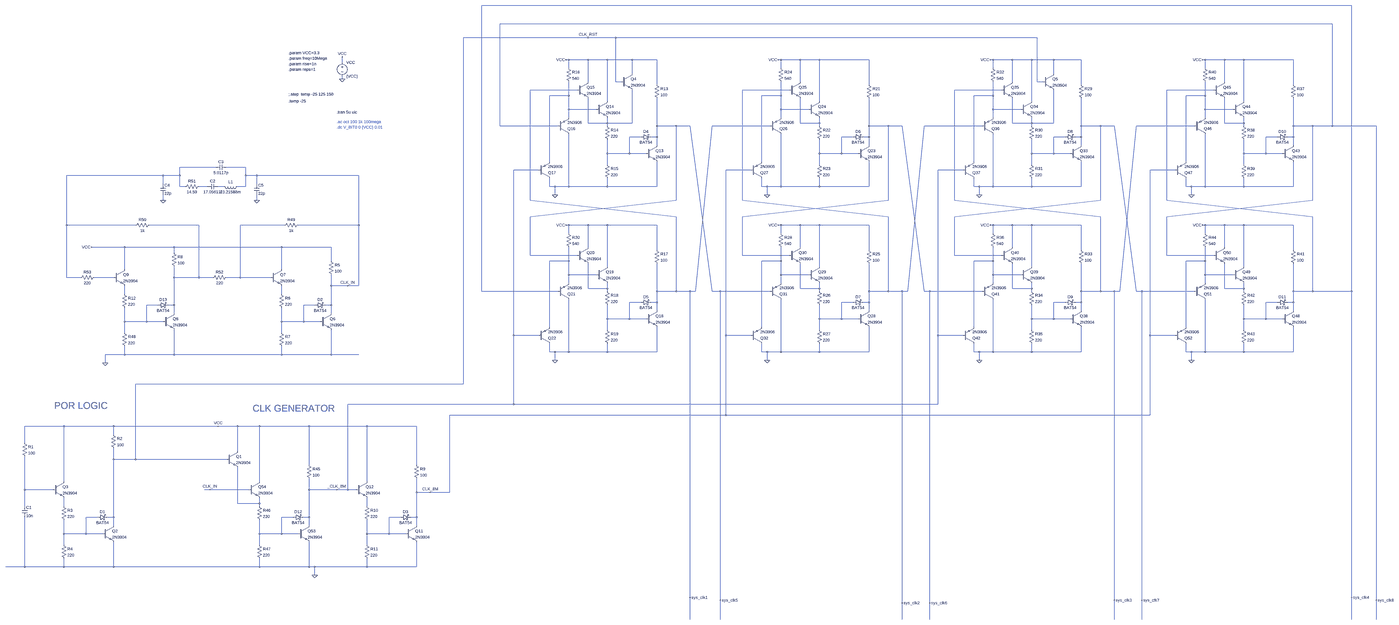
[diagram p0: schematic clock_gen.asc, whole sheet]
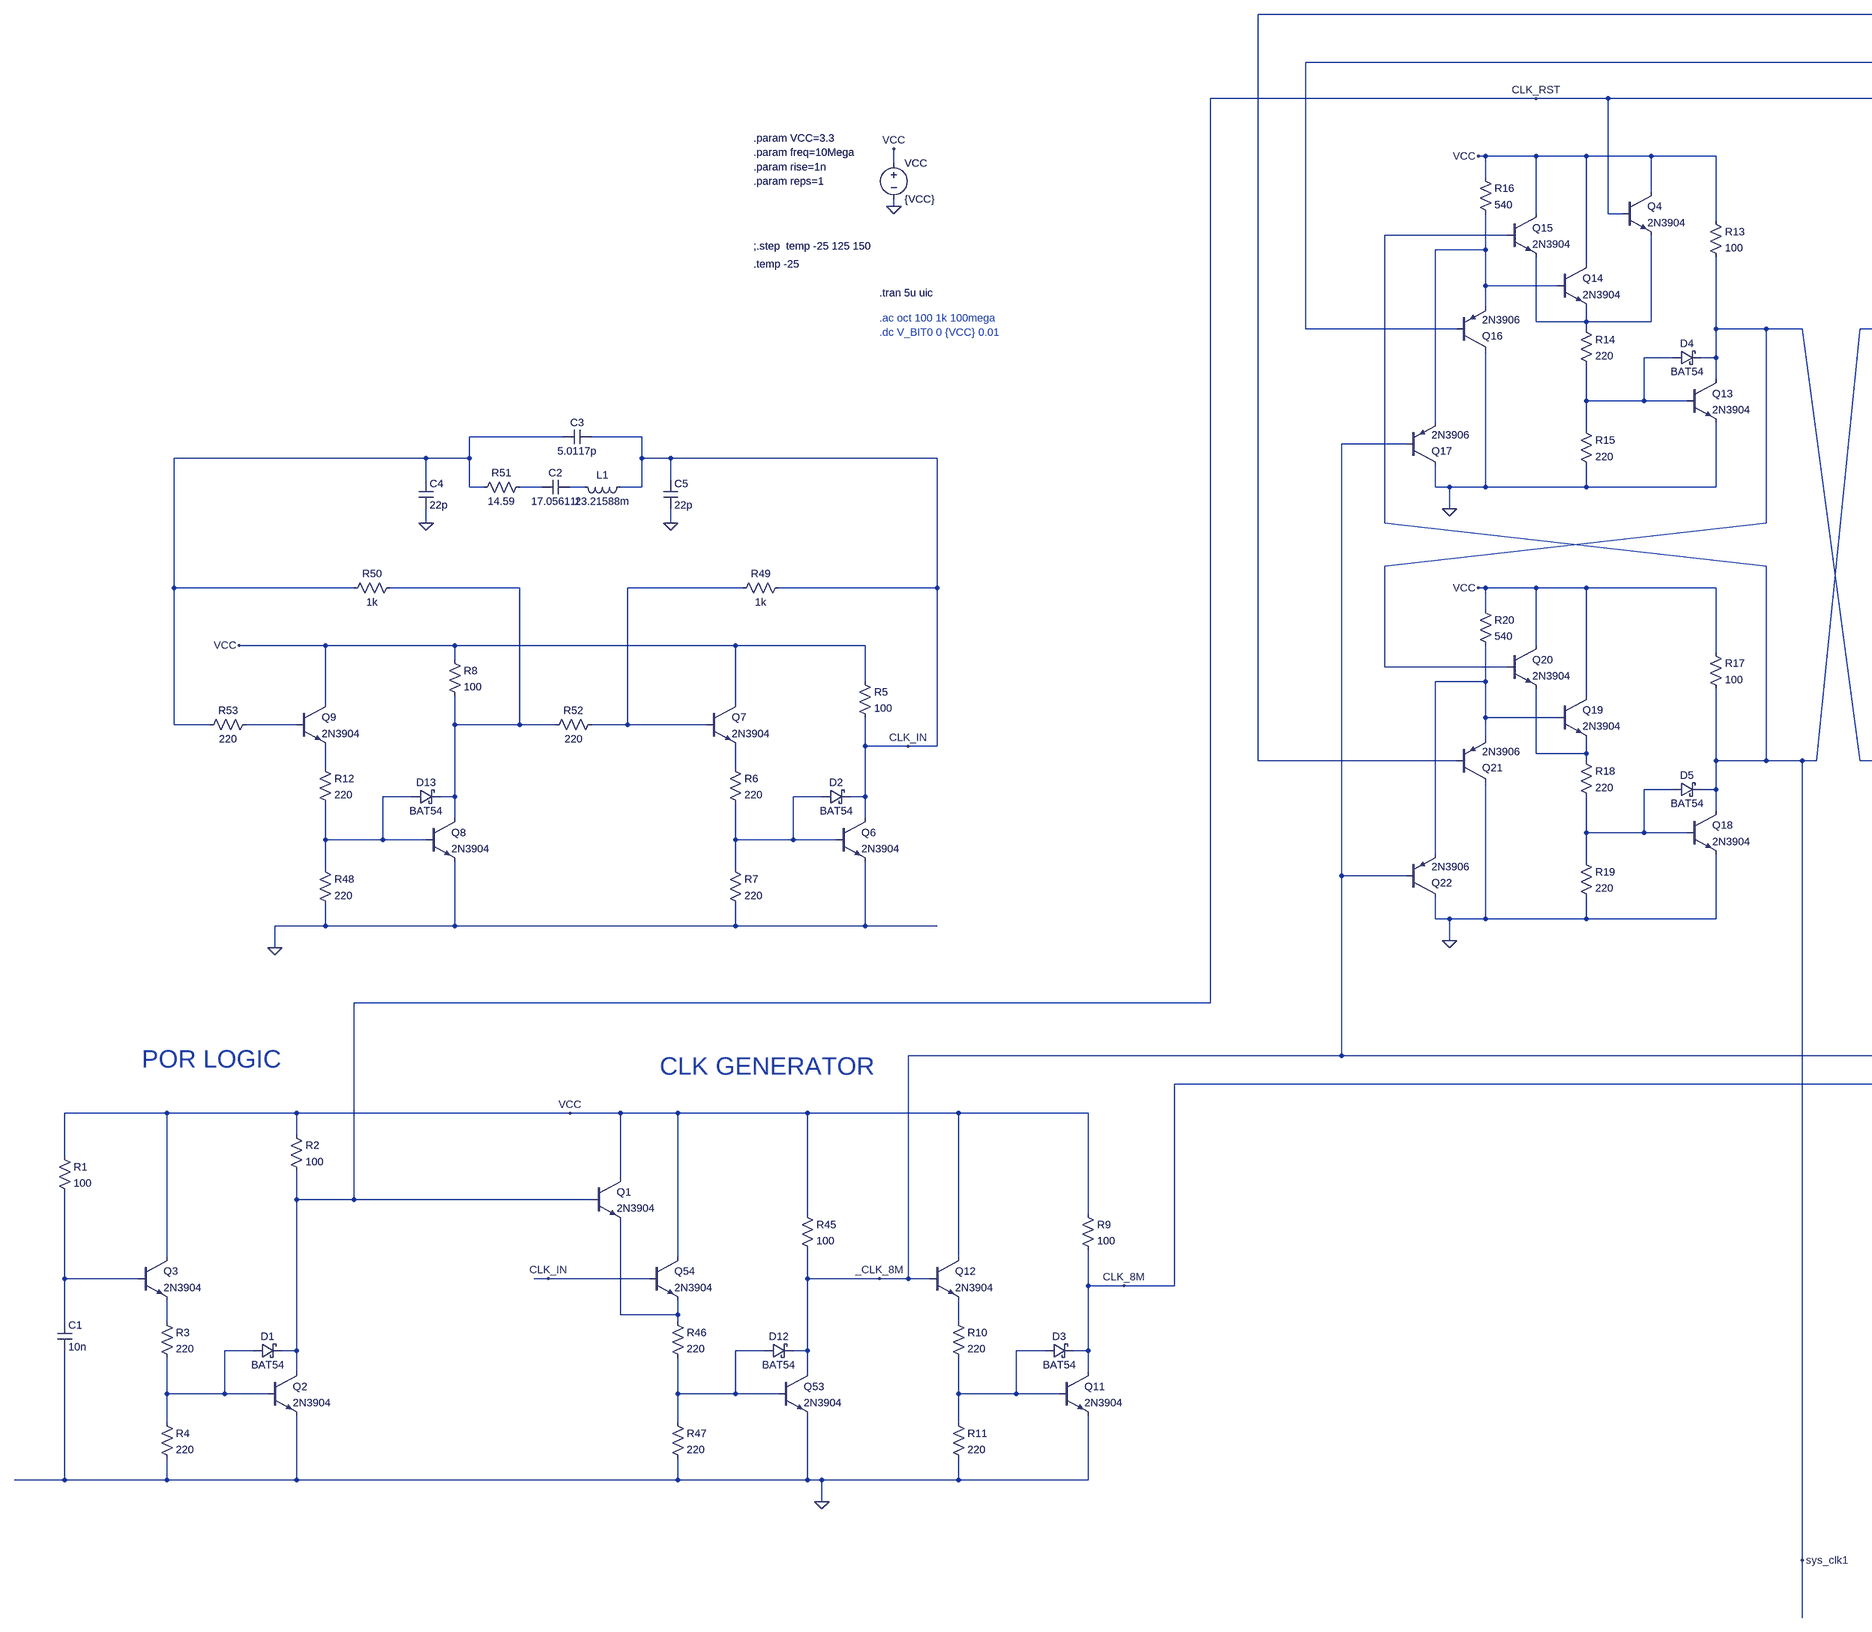
[diagram p1: schematic clock_gen.asc, part, row 1 of 1, column 1 of 2]
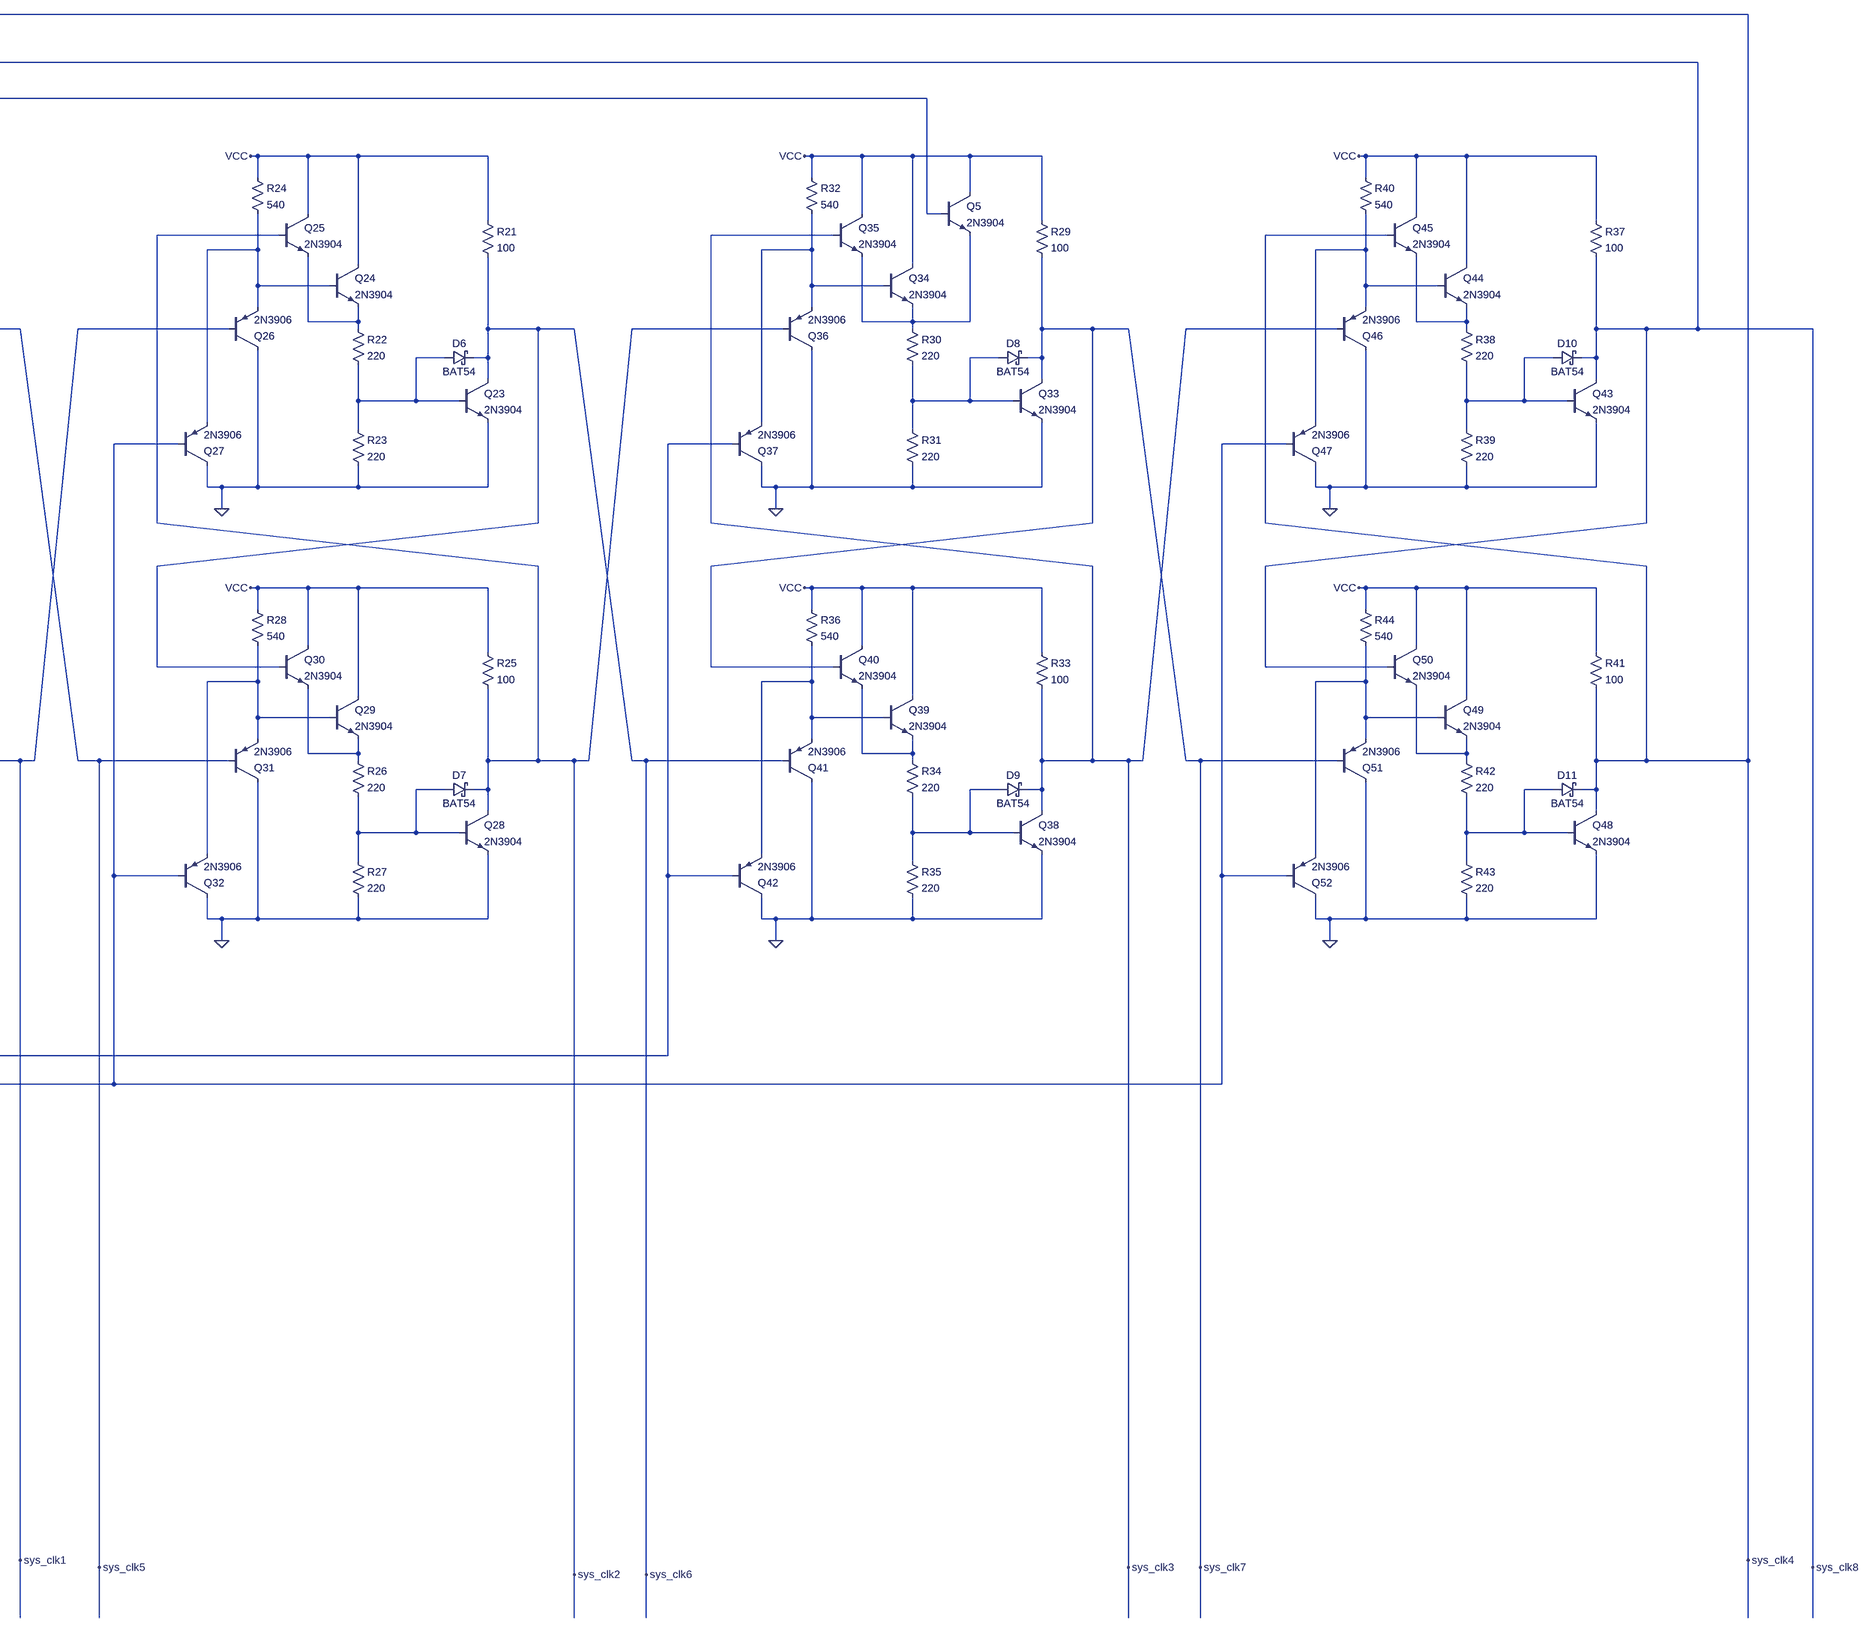
[diagram p2: schematic clock_gen.asc, part, row 1 of 1, column 2 of 2]
clock_gen.asc, the LTspice schematic file:
Version 4.1
SHEET 1 14868 10612
WIRE 8016 2768 2848 2768
WIRE 7904 2880 2992 2880
WIRE 3504 2960 2672 2960
WIRE 3664 2960 3504 2960
WIRE 6112 2960 3664 2960
WIRE 3392 3088 3376 3088
WIRE 3504 3088 3392 3088
WIRE 3616 3088 3504 3088
WIRE 3760 3088 3616 3088
WIRE 3904 3088 3760 3088
WIRE 4624 3088 4608 3088
WIRE 4736 3088 4624 3088
WIRE 4848 3088 4736 3088
WIRE 5136 3088 4848 3088
WIRE 5856 3088 5840 3088
WIRE 5968 3088 5856 3088
WIRE 6080 3088 5968 3088
WIRE 6208 3088 6080 3088
WIRE 6368 3088 6208 3088
WIRE 7088 3088 7072 3088
WIRE 7200 3088 7088 3088
WIRE 7312 3088 7200 3088
WIRE 7600 3088 7312 3088
WIRE 1968 3104 1968 3072
WIRE 3392 3136 3392 3088
WIRE 4624 3136 4624 3088
WIRE 5856 3136 5856 3088
WIRE 7088 3136 7088 3088
WIRE 3760 3168 3760 3088
WIRE 6208 3168 6208 3088
WIRE 1968 3200 1968 3184
WIRE 3504 3216 3504 3088
WIRE 3664 3216 3664 2960
WIRE 3696 3216 3664 3216
WIRE 4736 3216 4736 3088
WIRE 5968 3216 5968 3088
WIRE 6112 3216 6112 2960
WIRE 6144 3216 6112 3216
WIRE 7200 3216 7200 3088
WIRE 3904 3232 3904 3088
WIRE 5136 3232 5136 3088
WIRE 6368 3232 6368 3088
WIRE 7600 3232 7600 3088
WIRE 3440 3264 3168 3264
WIRE 4672 3264 4400 3264
WIRE 5904 3264 5632 3264
WIRE 7136 3264 6864 3264
WIRE 3392 3296 3392 3216
WIRE 3392 3296 3280 3296
WIRE 4624 3296 4624 3216
WIRE 4624 3296 4512 3296
WIRE 5856 3296 5856 3216
WIRE 5856 3296 5744 3296
WIRE 7088 3296 7088 3216
WIRE 7088 3296 6976 3296
WIRE 3616 3328 3616 3088
WIRE 4848 3328 4848 3088
WIRE 6080 3328 6080 3088
WIRE 7312 3328 7312 3088
WIRE 3392 3376 3392 3296
WIRE 3552 3376 3392 3376
WIRE 4624 3376 4624 3296
WIRE 4784 3376 4624 3376
WIRE 5856 3376 5856 3296
WIRE 6016 3376 5856 3376
WIRE 7088 3376 7088 3296
WIRE 7248 3376 7088 3376
WIRE 3392 3424 3392 3376
WIRE 4624 3424 4624 3376
WIRE 5856 3424 5856 3376
WIRE 7088 3424 7088 3376
WIRE 3504 3456 3504 3312
WIRE 3616 3456 3616 3424
WIRE 3616 3456 3504 3456
WIRE 3760 3456 3760 3264
WIRE 3760 3456 3616 3456
WIRE 4736 3456 4736 3312
WIRE 4848 3456 4848 3424
WIRE 4848 3456 4736 3456
WIRE 5968 3456 5968 3312
WIRE 6080 3456 6080 3424
WIRE 6080 3456 5968 3456
WIRE 6208 3456 6208 3264
WIRE 6208 3456 6080 3456
WIRE 7200 3456 7200 3312
WIRE 7312 3456 7312 3424
WIRE 7312 3456 7200 3456
WIRE 2992 3472 2992 2880
WIRE 3328 3472 2992 3472
WIRE 3616 3472 3616 3456
WIRE 3904 3472 3904 3312
WIRE 4016 3472 3904 3472
WIRE 4096 3472 4016 3472
WIRE 4560 3472 4224 3472
WIRE 4848 3472 4848 3456
WIRE 5136 3472 5136 3312
WIRE 5248 3472 5136 3472
WIRE 5328 3472 5248 3472
WIRE 5792 3472 5456 3472
WIRE 6080 3472 6080 3456
WIRE 6368 3472 6368 3312
WIRE 6480 3472 6368 3472
WIRE 6560 3472 6480 3472
WIRE 7024 3472 6688 3472
WIRE 7312 3472 7312 3456
WIRE 7600 3472 7600 3312
WIRE 7712 3472 7600 3472
WIRE 7904 3472 7904 2880
WIRE 7904 3472 7712 3472
WIRE 8160 3472 7904 3472
WIRE 3808 3536 3744 3536
WIRE 3904 3536 3904 3472
WIRE 3904 3536 3872 3536
WIRE 5040 3536 4976 3536
WIRE 5136 3536 5136 3472
WIRE 5136 3536 5104 3536
WIRE 6272 3536 6208 3536
WIRE 6368 3536 6368 3472
WIRE 6368 3536 6336 3536
WIRE 7504 3536 7440 3536
WIRE 7600 3536 7600 3472
WIRE 7600 3536 7568 3536
WIRE 3904 3584 3904 3536
WIRE 5136 3584 5136 3536
WIRE 6368 3584 6368 3536
WIRE 7600 3584 7600 3536
WIRE 3616 3632 3616 3552
WIRE 3744 3632 3744 3536
WIRE 3744 3632 3616 3632
WIRE 3840 3632 3744 3632
WIRE 4848 3632 4848 3552
WIRE 4976 3632 4976 3536
WIRE 4976 3632 4848 3632
WIRE 5072 3632 4976 3632
WIRE 6080 3632 6080 3552
WIRE 6208 3632 6208 3536
WIRE 6208 3632 6080 3632
WIRE 6304 3632 6208 3632
WIRE 7312 3632 7312 3552
WIRE 7440 3632 7440 3536
WIRE 7440 3632 7312 3632
WIRE 7536 3632 7440 3632
WIRE 3280 3680 3280 3296
WIRE 4512 3680 4512 3296
WIRE 5744 3680 5744 3296
WIRE 6976 3680 6976 3296
WIRE 3616 3696 3616 3632
WIRE 4848 3696 4848 3632
WIRE 6080 3696 6080 3632
WIRE 7312 3696 7312 3632
WIRE 1232 3712 1024 3712
WIRE 1408 3712 1296 3712
WIRE 3216 3728 3072 3728
WIRE 4448 3728 4304 3728
WIRE 5680 3728 5536 3728
WIRE 6912 3728 6768 3728
WIRE 928 3760 368 3760
WIRE 1024 3760 1024 3712
WIRE 1024 3760 928 3760
WIRE 1408 3760 1408 3712
WIRE 1472 3760 1408 3760
WIRE 2064 3760 1472 3760
WIRE 928 3808 928 3760
WIRE 1472 3808 1472 3760
WIRE 1024 3824 1024 3760
WIRE 1056 3824 1024 3824
WIRE 1184 3824 1136 3824
WIRE 1280 3824 1248 3824
WIRE 1408 3824 1408 3760
WIRE 1408 3824 1360 3824
WIRE 3280 3824 3280 3776
WIRE 3312 3824 3280 3824
WIRE 3392 3824 3392 3520
WIRE 3392 3824 3312 3824
WIRE 3616 3824 3616 3776
WIRE 3616 3824 3392 3824
WIRE 3904 3824 3904 3680
WIRE 3904 3824 3616 3824
WIRE 4512 3824 4512 3776
WIRE 4544 3824 4512 3824
WIRE 4624 3824 4624 3520
WIRE 4624 3824 4544 3824
WIRE 4848 3824 4848 3776
WIRE 4848 3824 4624 3824
WIRE 5136 3824 5136 3680
WIRE 5136 3824 4848 3824
WIRE 5744 3824 5744 3776
WIRE 5776 3824 5744 3824
WIRE 5856 3824 5856 3520
WIRE 5856 3824 5776 3824
WIRE 6080 3824 6080 3776
WIRE 6080 3824 5856 3824
WIRE 6368 3824 6368 3680
WIRE 6368 3824 6080 3824
WIRE 6976 3824 6976 3776
WIRE 7008 3824 6976 3824
WIRE 7088 3824 7088 3520
WIRE 7088 3824 7008 3824
WIRE 7312 3824 7312 3776
WIRE 7312 3824 7088 3824
WIRE 7600 3824 7600 3680
WIRE 7600 3824 7312 3824
WIRE 3312 3872 3312 3824
WIRE 4544 3872 4544 3824
WIRE 5776 3872 5776 3824
WIRE 7008 3872 7008 3824
WIRE 928 3904 928 3872
WIRE 1472 3904 1472 3872
WIRE 3168 3904 3168 3264
WIRE 4016 3904 4016 3472
WIRE 4400 3904 4400 3264
WIRE 5248 3904 5248 3472
WIRE 5632 3904 5632 3264
WIRE 6480 3904 6480 3472
WIRE 6864 3904 6864 3264
WIRE 7712 3904 7712 3472
WIRE 3168 4000 4016 3904
WIRE 4016 4000 3168 3904
WIRE 4400 4000 5248 3904
WIRE 5248 4000 4400 3904
WIRE 5632 4000 6480 3904
WIRE 6480 4000 5632 3904
WIRE 6864 4000 7712 3904
WIRE 7712 4000 6864 3904
WIRE 368 4048 368 3760
WIRE 768 4048 368 4048
WIRE 1136 4048 848 4048
WIRE 1632 4048 1376 4048
WIRE 2064 4048 2064 3760
WIRE 2064 4048 1712 4048
WIRE 3392 4048 3376 4048
WIRE 3504 4048 3392 4048
WIRE 3616 4048 3504 4048
WIRE 3904 4048 3616 4048
WIRE 4624 4048 4608 4048
WIRE 4736 4048 4624 4048
WIRE 4848 4048 4736 4048
WIRE 5136 4048 4848 4048
WIRE 5856 4048 5840 4048
WIRE 5968 4048 5856 4048
WIRE 6080 4048 5968 4048
WIRE 6368 4048 6080 4048
WIRE 7088 4048 7072 4048
WIRE 7200 4048 7088 4048
WIRE 7312 4048 7200 4048
WIRE 7600 4048 7312 4048
WIRE 3392 4096 3392 4048
WIRE 4624 4096 4624 4048
WIRE 5856 4096 5856 4048
WIRE 7088 4096 7088 4048
WIRE 704 4176 512 4176
WIRE 992 4176 704 4176
WIRE 1616 4176 992 4176
WIRE 1904 4176 1616 4176
WIRE 3504 4176 3504 4048
WIRE 4736 4176 4736 4048
WIRE 5968 4176 5968 4048
WIRE 7200 4176 7200 4048
WIRE 3904 4192 3904 4048
WIRE 5136 4192 5136 4048
WIRE 6368 4192 6368 4048
WIRE 7600 4192 7600 4048
WIRE 992 4208 992 4176
WIRE 3168 4224 3168 4000
WIRE 3440 4224 3168 4224
WIRE 4400 4224 4400 4000
WIRE 4672 4224 4400 4224
WIRE 5632 4224 5632 4000
WIRE 5904 4224 5632 4224
WIRE 6864 4224 6864 4000
WIRE 7136 4224 6864 4224
WIRE 1904 4256 1904 4176
WIRE 3392 4256 3392 4176
WIRE 3392 4256 3280 4256
WIRE 4624 4256 4624 4176
WIRE 4624 4256 4512 4256
WIRE 5856 4256 5856 4176
WIRE 5856 4256 5744 4256
WIRE 7088 4256 7088 4176
WIRE 7088 4256 6976 4256
WIRE 3616 4288 3616 4048
WIRE 4848 4288 4848 4048
WIRE 6080 4288 6080 4048
WIRE 7312 4288 7312 4048
WIRE 704 4304 704 4176
WIRE 1616 4304 1616 4176
WIRE 3392 4336 3392 4256
WIRE 3552 4336 3392 4336
WIRE 4624 4336 4624 4256
WIRE 4784 4336 4624 4336
WIRE 5856 4336 5856 4256
WIRE 6016 4336 5856 4336
WIRE 7088 4336 7088 4256
WIRE 7248 4336 7088 4336
WIRE 368 4352 368 4048
WIRE 448 4352 368 4352
WIRE 640 4352 528 4352
WIRE 992 4352 992 4288
WIRE 1136 4352 1136 4048
WIRE 1136 4352 992 4352
WIRE 1216 4352 1136 4352
WIRE 1376 4352 1376 4048
WIRE 1376 4352 1296 4352
WIRE 1552 4352 1376 4352
WIRE 3392 4384 3392 4336
WIRE 4624 4384 4624 4336
WIRE 5856 4384 5856 4336
WIRE 7088 4384 7088 4336
WIRE 1904 4400 1904 4336
WIRE 2000 4400 1904 4400
WIRE 2064 4400 2064 4048
WIRE 2064 4400 2000 4400
WIRE 3504 4416 3504 4272
WIRE 3616 4416 3616 4384
WIRE 3616 4416 3504 4416
WIRE 4736 4416 4736 4272
WIRE 4848 4416 4848 4384
WIRE 4848 4416 4736 4416
WIRE 5968 4416 5968 4272
WIRE 6080 4416 6080 4384
WIRE 6080 4416 5968 4416
WIRE 7200 4416 7200 4272
WIRE 7312 4416 7312 4384
WIRE 7312 4416 7200 4416
WIRE 2848 4432 2848 2768
WIRE 3328 4432 2848 4432
WIRE 3616 4432 3616 4416
WIRE 3904 4432 3904 4272
WIRE 4016 4432 4016 4000
WIRE 4016 4432 3904 4432
WIRE 4096 4432 4016 4432
WIRE 4128 4432 4224 3472
WIRE 4128 4432 4096 4432
WIRE 4224 4432 4096 3472
WIRE 4272 4432 4224 4432
WIRE 4560 4432 4272 4432
WIRE 4848 4432 4848 4416
WIRE 5136 4432 5136 4272
WIRE 5248 4432 5248 4000
WIRE 5248 4432 5136 4432
WIRE 5328 4432 5248 4432
WIRE 5360 4432 5456 3472
WIRE 5360 4432 5328 4432
WIRE 5456 4432 5328 3472
WIRE 5488 4432 5456 4432
WIRE 5792 4432 5488 4432
WIRE 6080 4432 6080 4416
WIRE 6368 4432 6368 4272
WIRE 6480 4432 6480 4000
WIRE 6480 4432 6368 4432
WIRE 6560 4432 6480 4432
WIRE 6592 4432 6688 3472
WIRE 6592 4432 6560 4432
WIRE 6688 4432 6560 3472
WIRE 6720 4432 6688 4432
WIRE 7024 4432 6720 4432
WIRE 7312 4432 7312 4416
WIRE 7600 4432 7600 4272
WIRE 7712 4432 7712 4000
WIRE 7712 4432 7600 4432
WIRE 8016 4432 8016 2768
WIRE 8016 4432 7712 4432
WIRE 704 4448 704 4400
WIRE 1616 4448 1616 4400
WIRE 3808 4496 3744 4496
WIRE 3904 4496 3904 4432
WIRE 3904 4496 3872 4496
WIRE 5040 4496 4976 4496
WIRE 5136 4496 5136 4432
WIRE 5136 4496 5104 4496
WIRE 6272 4496 6208 4496
WIRE 6368 4496 6368 4432
WIRE 6368 4496 6336 4496
WIRE 7504 4496 7440 4496
WIRE 7600 4496 7600 4432
WIRE 7600 4496 7568 4496
WIRE 896 4512 832 4512
WIRE 992 4512 992 4352
WIRE 992 4512 960 4512
WIRE 1808 4512 1744 4512
WIRE 1904 4512 1904 4400
WIRE 1904 4512 1872 4512
WIRE 3904 4544 3904 4496
WIRE 5136 4544 5136 4496
WIRE 6368 4544 6368 4496
WIRE 7600 4544 7600 4496
WIRE 992 4560 992 4512
WIRE 1904 4560 1904 4512
WIRE 3616 4592 3616 4512
WIRE 3744 4592 3744 4496
WIRE 3744 4592 3616 4592
WIRE 3840 4592 3744 4592
WIRE 4848 4592 4848 4512
WIRE 4976 4592 4976 4496
WIRE 4976 4592 4848 4592
WIRE 5072 4592 4976 4592
WIRE 6080 4592 6080 4512
WIRE 6208 4592 6208 4496
WIRE 6208 4592 6080 4592
WIRE 6304 4592 6208 4592
WIRE 7312 4592 7312 4512
WIRE 7440 4592 7440 4496
WIRE 7440 4592 7312 4592
WIRE 7536 4592 7440 4592
WIRE 704 4608 704 4528
WIRE 832 4608 832 4512
WIRE 832 4608 704 4608
WIRE 928 4608 832 4608
WIRE 1616 4608 1616 4528
WIRE 1744 4608 1744 4512
WIRE 1744 4608 1616 4608
WIRE 1840 4608 1744 4608
WIRE 3280 4640 3280 4256
WIRE 4512 4640 4512 4256
WIRE 5744 4640 5744 4256
WIRE 6976 4640 6976 4256
WIRE 3616 4656 3616 4592
WIRE 4848 4656 4848 4592
WIRE 6080 4656 6080 4592
WIRE 7312 4656 7312 4592
WIRE 704 4672 704 4608
WIRE 1616 4672 1616 4608
WIRE 3072 4688 3072 3728
WIRE 3216 4688 3072 4688
WIRE 4304 4688 4304 3728
WIRE 4448 4688 4304 4688
WIRE 5536 4688 5536 3728
WIRE 5680 4688 5536 4688
WIRE 6768 4688 6768 3728
WIRE 6912 4688 6768 4688
WIRE 3280 4784 3280 4736
WIRE 3312 4784 3280 4784
WIRE 3392 4784 3392 4480
WIRE 3392 4784 3312 4784
WIRE 3616 4784 3616 4736
WIRE 3616 4784 3392 4784
WIRE 3904 4784 3904 4640
WIRE 3904 4784 3616 4784
WIRE 4512 4784 4512 4736
WIRE 4544 4784 4512 4784
WIRE 4624 4784 4624 4480
WIRE 4624 4784 4544 4784
WIRE 4848 4784 4848 4736
WIRE 4848 4784 4624 4784
WIRE 5136 4784 5136 4640
WIRE 5136 4784 4848 4784
WIRE 5744 4784 5744 4736
WIRE 5776 4784 5744 4784
WIRE 5856 4784 5856 4480
WIRE 5856 4784 5776 4784
WIRE 6080 4784 6080 4736
WIRE 6080 4784 5856 4784
WIRE 6368 4784 6368 4640
WIRE 6368 4784 6080 4784
WIRE 6976 4784 6976 4736
WIRE 7008 4784 6976 4784
WIRE 7088 4784 7088 4480
WIRE 7088 4784 7008 4784
WIRE 7312 4784 7312 4736
WIRE 7312 4784 7088 4784
WIRE 7600 4784 7600 4640
WIRE 7600 4784 7312 4784
WIRE 704 4800 704 4752
WIRE 704 4800 592 4800
WIRE 992 4800 992 4656
WIRE 992 4800 704 4800
WIRE 1616 4800 1616 4752
WIRE 1616 4800 992 4800
WIRE 1904 4800 1904 4656
WIRE 1904 4800 1616 4800
WIRE 2064 4800 1904 4800
WIRE 3312 4832 3312 4784
WIRE 4544 4832 4544 4784
WIRE 5776 4832 5776 4784
WIRE 7008 4832 7008 4784
WIRE 592 4848 592 4800
WIRE 2672 5232 2672 2960
WIRE 2672 5232 768 5232
WIRE 3072 5376 3072 4688
WIRE 3072 5376 2000 5376
WIRE 5536 5376 5536 4688
WIRE 5536 5376 3072 5376
WIRE 4304 5440 4304 4688
WIRE 4304 5440 2592 5440
WIRE 6768 5440 6768 4688
WIRE 6768 5440 4304 5440
WIRE 352 5504 48 5504
WIRE 640 5504 352 5504
WIRE 1248 5504 640 5504
WIRE 1360 5504 1248 5504
WIRE 1488 5504 1360 5504
WIRE 1776 5504 1488 5504
WIRE 2112 5504 1776 5504
WIRE 2400 5504 2112 5504
WIRE 640 5552 640 5504
WIRE 48 5600 48 5504
WIRE 1360 5648 1360 5504
WIRE 640 5696 640 5632
WIRE 768 5696 768 5232
WIRE 768 5696 640 5696
WIRE 1296 5696 768 5696
WIRE 1776 5728 1776 5504
WIRE 2400 5728 2400 5504
WIRE 352 5824 352 5504
WIRE 1488 5824 1488 5504
WIRE 2112 5824 2112 5504
WIRE 48 5872 48 5680
WIRE 288 5872 48 5872
WIRE 1200 5872 1168 5872
WIRE 1424 5872 1200 5872
WIRE 1776 5872 1776 5808
WIRE 1936 5872 1776 5872
WIRE 2000 5872 2000 5376
WIRE 2000 5872 1936 5872
WIRE 2048 5872 2000 5872
WIRE 2400 5888 2400 5808
WIRE 2480 5888 2400 5888
WIRE 2592 5888 2592 5440
WIRE 2592 5888 2480 5888
WIRE 1360 5952 1360 5744
WIRE 1488 5952 1488 5920
WIRE 1488 5952 1360 5952
WIRE 48 5968 48 5872
WIRE 352 5968 352 5920
WIRE 1488 5968 1488 5952
WIRE 2112 5968 2112 5920
WIRE 544 6032 480 6032
WIRE 640 6032 640 5696
WIRE 640 6032 608 6032
WIRE 1680 6032 1616 6032
WIRE 1776 6032 1776 5872
WIRE 1776 6032 1744 6032
WIRE 2304 6032 2240 6032
WIRE 2400 6032 2400 5888
WIRE 2400 6032 2368 6032
WIRE 640 6080 640 6032
WIRE 1776 6080 1776 6032
WIRE 2400 6080 2400 6032
WIRE 352 6128 352 6048
WIRE 480 6128 480 6032
WIRE 480 6128 352 6128
WIRE 576 6128 480 6128
WIRE 1488 6128 1488 6048
WIRE 1616 6128 1616 6032
WIRE 1616 6128 1488 6128
WIRE 1712 6128 1616 6128
WIRE 2112 6128 2112 6048
WIRE 2240 6128 2240 6032
WIRE 2240 6128 2112 6128
WIRE 2336 6128 2240 6128
WIRE 352 6192 352 6128
WIRE 1488 6192 1488 6128
WIRE 2112 6192 2112 6128
WIRE 48 6320 48 6032
WIRE 48 6320 -64 6320
WIRE 352 6320 352 6272
WIRE 352 6320 48 6320
WIRE 640 6320 640 6176
WIRE 640 6320 352 6320
WIRE 1488 6320 1488 6272
WIRE 1488 6320 640 6320
WIRE 1776 6320 1776 6176
WIRE 1776 6320 1488 6320
WIRE 1808 6320 1776 6320
WIRE 2112 6320 2112 6272
WIRE 2112 6320 1808 6320
WIRE 2400 6320 2400 6176
WIRE 2400 6320 2112 6320
WIRE 1808 6368 1808 6320
WIRE 4096 6928 4096 4432
WIRE 8016 6928 8016 4432
WIRE 4272 6944 4272 4432
WIRE 6560 6944 6560 4432
WIRE 6720 6944 6720 4432
WIRE 8160 6944 8160 3472
WIRE 5328 6960 5328 4432
WIRE 5488 6960 5488 4432
WIRE 4096 7056 4096 6928
WIRE 4272 7056 4272 6944
WIRE 5328 7056 5328 6960
WIRE 5488 7056 5488 6960
WIRE 6560 7056 6560 6944
WIRE 6720 7056 6720 6944
WIRE 8016 7056 8016 6928
WIRE 8160 7056 8160 6944
FLAG 1968 3200 0
FLAG 1968 3072 VCC
FLAG 1808 6368 0
FLAG 1936 5872 _CLK_8M
FLAG 2480 5888 CLK_8M
FLAG 3312 3872 0
FLAG 3376 3088 VCC
FLAG 3312 4832 0
FLAG 3376 4048 VCC
FLAG 4544 3872 0
FLAG 4608 3088 VCC
FLAG 4544 4832 0
FLAG 4608 4048 VCC
FLAG 5776 3872 0
FLAG 5840 3088 VCC
FLAG 5776 4832 0
FLAG 5840 4048 VCC
FLAG 7008 3872 0
FLAG 7072 3088 VCC
FLAG 7008 4832 0
FLAG 7072 4048 VCC
FLAG 1200 5872 CLK_IN
FLAG 1248 5504 VCC
FLAG 3504 2960 CLK_RST
FLAG 4096 6928 sys_clk1
FLAG 5328 6960 sys_clk2
FLAG 6560 6944 sys_clk3
FLAG 8016 6928 sys_clk4
FLAG 4272 6944 sys_clk5
FLAG 5488 6960 sys_clk6
FLAG 6720 6944 sys_clk7
FLAG 8160 6944 sys_clk8
FLAG 2000 4400 CLK_IN
FLAG 512 4176 VCC
FLAG 592 4848 0
FLAG 928 3904 0
FLAG 1472 3904 0
SYMBOL voltage 1968 3088 R0
WINDOW 123 0 0 Left 0
WINDOW 39 0 0 Left 0
SYMATTR InstName VCC
SYMATTR Value {VCC}
SYMBOL npn 2336 6080 R0
SYMATTR InstName Q11
SYMATTR Value 2N3904
SYMBOL schottky 2304 6048 R270
WINDOW 0 32 32 VTop 2
WINDOW 3 0 32 VBottom 2
SYMATTR InstName D3
SYMATTR Value BAT54
SYMATTR Description Diode
SYMATTR Type diode
SYMBOL npn 2048 5824 R0
SYMATTR InstName Q12
SYMATTR Value 2N3904
SYMBOL res 2384 5712 R0
SYMATTR InstName R9
SYMATTR Value 100
SYMBOL res 2096 5952 R0
SYMATTR InstName R10
SYMATTR Value 220
SYMBOL res 2096 6176 R0
SYMATTR InstName R11
SYMATTR Value 220
SYMBOL npn 3840 3584 R0
SYMATTR InstName Q13
SYMATTR Value 2N3904
SYMBOL schottky 3808 3552 R270
WINDOW 0 32 32 VTop 2
WINDOW 3 0 32 VBottom 2
SYMATTR InstName D4
SYMATTR Value BAT54
SYMATTR Description Diode
SYMATTR Type diode
SYMBOL npn 3552 3328 R0
SYMATTR InstName Q14
SYMATTR Value 2N3904
SYMBOL res 3888 3216 R0
SYMATTR InstName R13
SYMATTR Value 100
SYMBOL res 3600 3456 R0
SYMATTR InstName R14
SYMATTR Value 220
SYMBOL res 3600 3680 R0
SYMATTR InstName R15
SYMATTR Value 220
SYMBOL npn 3440 3216 R0
SYMATTR InstName Q15
SYMATTR Value 2N3904
SYMBOL pnp 3328 3520 M180
SYMATTR InstName Q16
SYMATTR Value 2N3906
SYMBOL pnp 3216 3776 M180
SYMATTR InstName Q17
SYMATTR Value 2N3906
SYMBOL res 3376 3120 R0
SYMATTR InstName R16
SYMATTR Value 540
SYMBOL npn 3840 4544 R0
SYMATTR InstName Q18
SYMATTR Value 2N3904
SYMBOL schottky 3808 4512 R270
WINDOW 0 32 32 VTop 2
WINDOW 3 0 32 VBottom 2
SYMATTR InstName D5
SYMATTR Value BAT54
SYMATTR Description Diode
SYMATTR Type diode
SYMBOL npn 3552 4288 R0
SYMATTR InstName Q19
SYMATTR Value 2N3904
SYMBOL res 3888 4176 R0
SYMATTR InstName R17
SYMATTR Value 100
SYMBOL res 3600 4416 R0
SYMATTR InstName R18
SYMATTR Value 220
SYMBOL res 3600 4640 R0
SYMATTR InstName R19
SYMATTR Value 220
SYMBOL npn 3440 4176 R0
SYMATTR InstName Q20
SYMATTR Value 2N3904
SYMBOL pnp 3328 4480 M180
SYMATTR InstName Q21
SYMATTR Value 2N3906
SYMBOL pnp 3216 4736 M180
SYMATTR InstName Q22
SYMATTR Value 2N3906
SYMBOL res 3376 4080 R0
SYMATTR InstName R20
SYMATTR Value 540
SYMBOL npn 5072 3584 R0
SYMATTR InstName Q23
SYMATTR Value 2N3904
SYMBOL schottky 5040 3552 R270
WINDOW 0 32 32 VTop 2
WINDOW 3 0 32 VBottom 2
SYMATTR InstName D6
SYMATTR Value BAT54
SYMATTR Description Diode
SYMATTR Type diode
SYMBOL npn 4784 3328 R0
SYMATTR InstName Q24
SYMATTR Value 2N3904
SYMBOL res 5120 3216 R0
SYMATTR InstName R21
SYMATTR Value 100
SYMBOL res 4832 3456 R0
SYMATTR InstName R22
SYMATTR Value 220
SYMBOL res 4832 3680 R0
SYMATTR InstName R23
SYMATTR Value 220
SYMBOL npn 4672 3216 R0
SYMATTR InstName Q25
SYMATTR Value 2N3904
SYMBOL pnp 4560 3520 M180
SYMATTR InstName Q26
SYMATTR Value 2N3906
SYMBOL pnp 4448 3776 M180
SYMATTR InstName Q27
SYMATTR Value 2N3906
SYMBOL res 4608 3120 R0
SYMATTR InstName R24
SYMATTR Value 540
SYMBOL npn 5072 4544 R0
SYMATTR InstName Q28
SYMATTR Value 2N3904
SYMBOL schottky 5040 4512 R270
WINDOW 0 32 32 VTop 2
WINDOW 3 0 32 VBottom 2
SYMATTR InstName D7
SYMATTR Value BAT54
SYMATTR Description Diode
SYMATTR Type diode
SYMBOL npn 4784 4288 R0
SYMATTR InstName Q29
SYMATTR Value 2N3904
SYMBOL res 5120 4176 R0
SYMATTR InstName R25
SYMATTR Value 100
SYMBOL res 4832 4416 R0
SYMATTR InstName R26
SYMATTR Value 220
SYMBOL res 4832 4640 R0
SYMATTR InstName R27
SYMATTR Value 220
SYMBOL npn 4672 4176 R0
SYMATTR InstName Q30
SYMATTR Value 2N3904
SYMBOL pnp 4560 4480 M180
SYMATTR InstName Q31
SYMATTR Value 2N3906
SYMBOL pnp 4448 4736 M180
SYMATTR InstName Q32
SYMATTR Value 2N3906
SYMBOL res 4608 4080 R0
SYMATTR InstName R28
SYMATTR Value 540
SYMBOL npn 6304 3584 R0
SYMATTR InstName Q33
SYMATTR Value 2N3904
SYMBOL schottky 6272 3552 R270
WINDOW 0 32 32 VTop 2
WINDOW 3 0 32 VBottom 2
SYMATTR InstName D8
SYMATTR Value BAT54
SYMATTR Description Diode
SYMATTR Type diode
SYMBOL npn 6016 3328 R0
SYMATTR InstName Q34
SYMATTR Value 2N3904
SYMBOL res 6352 3216 R0
SYMATTR InstName R29
SYMATTR Value 100
SYMBOL res 6064 3456 R0
SYMATTR InstName R30
SYMATTR Value 220
SYMBOL res 6064 3680 R0
SYMATTR InstName R31
SYMATTR Value 220
SYMBOL npn 5904 3216 R0
SYMATTR InstName Q35
SYMATTR Value 2N3904
SYMBOL pnp 5792 3520 M180
SYMATTR InstName Q36
SYMATTR Value 2N3906
SYMBOL pnp 5680 3776 M180
SYMATTR InstName Q37
SYMATTR Value 2N3906
SYMBOL res 5840 3120 R0
SYMATTR InstName R32
SYMATTR Value 540
SYMBOL npn 6304 4544 R0
SYMATTR InstName Q38
SYMATTR Value 2N3904
SYMBOL schottky 6272 4512 R270
WINDOW 0 32 32 VTop 2
WINDOW 3 0 32 VBottom 2
SYMATTR InstName D9
SYMATTR Value BAT54
SYMATTR Description Diode
SYMATTR Type diode
SYMBOL npn 6016 4288 R0
SYMATTR InstName Q39
SYMATTR Value 2N3904
SYMBOL res 6352 4176 R0
SYMATTR InstName R33
SYMATTR Value 100
SYMBOL res 6064 4416 R0
SYMATTR InstName R34
SYMATTR Value 220
SYMBOL res 6064 4640 R0
SYMATTR InstName R35
SYMATTR Value 220
SYMBOL npn 5904 4176 R0
SYMATTR InstName Q40
SYMATTR Value 2N3904
SYMBOL pnp 5792 4480 M180
SYMATTR InstName Q41
SYMATTR Value 2N3906
SYMBOL pnp 5680 4736 M180
SYMATTR InstName Q42
SYMATTR Value 2N3906
SYMBOL res 5840 4080 R0
SYMATTR InstName R36
SYMATTR Value 540
SYMBOL npn 7536 3584 R0
SYMATTR InstName Q43
SYMATTR Value 2N3904
SYMBOL schottky 7504 3552 R270
WINDOW 0 32 32 VTop 2
WINDOW 3 0 32 VBottom 2
SYMATTR InstName D10
SYMATTR Value BAT54
SYMATTR Description Diode
SYMATTR Type diode
SYMBOL npn 7248 3328 R0
SYMATTR InstName Q44
SYMATTR Value 2N3904
SYMBOL res 7584 3216 R0
SYMATTR InstName R37
SYMATTR Value 100
SYMBOL res 7296 3456 R0
SYMATTR InstName R38
SYMATTR Value 220
SYMBOL res 7296 3680 R0
SYMATTR InstName R39
SYMATTR Value 220
SYMBOL npn 7136 3216 R0
SYMATTR InstName Q45
SYMATTR Value 2N3904
SYMBOL pnp 7024 3520 M180
SYMATTR InstName Q46
SYMATTR Value 2N3906
SYMBOL pnp 6912 3776 M180
SYMATTR InstName Q47
SYMATTR Value 2N3906
SYMBOL res 7072 3120 R0
SYMATTR InstName R40
SYMATTR Value 540
SYMBOL npn 7536 4544 R0
SYMATTR InstName Q48
SYMATTR Value 2N3904
SYMBOL schottky 7504 4512 R270
WINDOW 0 32 32 VTop 2
WINDOW 3 0 32 VBottom 2
SYMATTR InstName D11
SYMATTR Value BAT54
SYMATTR Description Diode
SYMATTR Type diode
SYMBOL npn 7248 4288 R0
SYMATTR InstName Q49
SYMATTR Value 2N3904
SYMBOL res 7584 4176 R0
SYMATTR InstName R41
SYMATTR Value 100
SYMBOL res 7296 4416 R0
SYMATTR InstName R42
SYMATTR Value 220
SYMBOL res 7296 4640 R0
SYMATTR InstName R43
SYMATTR Value 220
SYMBOL npn 7136 4176 R0
SYMATTR InstName Q50
SYMATTR Value 2N3904
SYMBOL pnp 7024 4480 M180
SYMATTR InstName Q51
SYMATTR Value 2N3906
SYMBOL pnp 6912 4736 M180
SYMATTR InstName Q52
SYMATTR Value 2N3906
SYMBOL res 7072 4080 R0
SYMATTR InstName R44
SYMATTR Value 540
SYMBOL npn 1712 6080 R0
SYMATTR InstName Q53
SYMATTR Value 2N3904
SYMBOL schottky 1680 6048 R270
WINDOW 0 32 32 VTop 2
WINDOW 3 0 32 VBottom 2
SYMATTR InstName D12
SYMATTR Value BAT54
SYMATTR Description Diode
SYMATTR Type diode
SYMBOL npn 1424 5824 R0
SYMATTR InstName Q54
SYMATTR Value 2N3904
SYMBOL res 1760 5712 R0
SYMATTR InstName R45
SYMATTR Value 100
SYMBOL res 1472 5952 R0
SYMATTR InstName R46
SYMATTR Value 220
SYMBOL res 1472 6176 R0
SYMATTR InstName R47
SYMATTR Value 220
SYMBOL npn 1296 5648 R0
SYMATTR InstName Q1
SYMATTR Value 2N3904
SYMBOL res 32 5584 R0
SYMATTR InstName R1
SYMATTR Value 100
SYMBOL cap 32 5968 R0
SYMATTR InstName C1
SYMATTR Value 10n
SYMBOL npn 576 6080 R0
SYMATTR InstName Q2
SYMATTR Value 2N3904
SYMBOL schottky 544 6048 R270
WINDOW 0 32 32 VTop 2
WINDOW 3 0 32 VBottom 2
SYMATTR InstName D1
SYMATTR Value BAT54
SYMATTR Description Diode
SYMATTR Type diode
SYMBOL npn 288 5824 R0
SYMATTR InstName Q3
SYMATTR Value 2N3904
SYMBOL res 624 5536 R0
SYMATTR InstName R2
SYMATTR Value 100
SYMBOL res 336 5952 R0
SYMATTR InstName R3
SYMATTR Value 220
SYMBOL res 336 6176 R0
SYMATTR InstName R4
SYMATTR Value 220
SYMBOL npn 3696 3168 R0
SYMATTR InstName Q4
SYMATTR Value 2N3904
SYMBOL npn 6144 3168 R0
SYMATTR InstName Q5
SYMATTR Value 2N3904
SYMBOL npn 1840 4560 R0
SYMATTR InstName Q6
SYMATTR Value 2N3904
SYMBOL schottky 1808 4528 R270
WINDOW 0 32 32 VTop 2
WINDOW 3 0 32 VBottom 2
SYMATTR InstName D2
SYMATTR Value BAT54
SYMATTR Description Diode
SYMATTR Type diode
SYMBOL npn 1552 4304 R0
SYMATTR InstName Q7
SYMATTR Value 2N3904
SYMBOL res 1888 4240 R0
SYMATTR InstName R5
SYMATTR Value 100
SYMBOL res 1600 4432 R0
SYMATTR InstName R6
SYMATTR Value 220
SYMBOL res 1600 4656 R0
SYMATTR InstName R7
SYMATTR Value 220
SYMBOL npn 928 4560 R0
SYMATTR InstName Q8
SYMATTR Value 2N3904
SYMBOL schottky 896 4528 R270
WINDOW 0 32 32 VTop 2
WINDOW 3 0 32 VBottom 2
SYMATTR InstName D13
SYMATTR Value BAT54
SYMATTR Description Diode
SYMATTR Type diode
SYMBOL npn 640 4304 R0
SYMATTR InstName Q9
SYMATTR Value 2N3904
SYMBOL res 976 4192 R0
SYMATTR InstName R8
SYMATTR Value 100
SYMBOL res 688 4432 R0
SYMATTR InstName R12
SYMATTR Value 220
SYMBOL res 688 4656 R0
SYMATTR InstName R48
SYMATTR Value 220
SYMBOL res 1728 4032 R90
WINDOW 0 0 56 VBottom 2
WINDOW 3 32 56 VTop 2
SYMATTR InstName R49
SYMATTR Value 1k
SYMBOL res 864 4032 R90
WINDOW 0 0 56 VBottom 2
WINDOW 3 32 56 VTop 2
SYMATTR InstName R50
SYMATTR Value 1k
SYMBOL ind 1376 3808 R90
WINDOW 0 5 56 VBottom 2
WINDOW 3 32 56 VTop 2
SYMATTR InstName L1
SYMATTR Value 23.21588m
SYMBOL cap 1184 3840 R270
WINDOW 0 32 32 VTop 2
WINDOW 3 0 32 VBottom 2
SYMATTR InstName C2
SYMATTR Value 17.05611f
SYMBOL cap 1232 3728 R270
WINDOW 0 32 32 VTop 2
WINDOW 3 0 32 VBottom 2
SYMATTR InstName C3
SYMATTR Value 5.0117p
SYMBOL res 1040 3840 R270
WINDOW 0 32 56 VTop 2
WINDOW 3 0 56 VBottom 2
SYMATTR InstName R51
SYMATTR Value 14.59
SYMBOL res 1312 4336 R90
WINDOW 0 0 56 VBottom 2
WINDOW 3 32 56 VTop 2
SYMATTR InstName R52
SYMATTR Value 220
SYMBOL res 544 4336 R90
WINDOW 0 0 56 VBottom 2
WINDOW 3 32 56 VTop 2
SYMATTR InstName R53
SYMATTR Value 220
SYMBOL cap 912 3808 R0
SYMATTR InstName C4
SYMATTR Value 22p
SYMBOL cap 1456 3808 R0
SYMATTR InstName C5
SYMATTR Value 22p
TEXT 1936 3392 Left 2 !.tran 5u uic
TEXT 1936 3448 Left 2 ;.ac oct 100 1k 100mega
TEXT 1936 3480 Left 2 ;.dc V_BIT0 0 {VCC} 0.01
TEXT 1656 3048 Left 2 !.param VCC=3.3
TEXT 1656 3080 Left 2 !.param freq=10Mega
TEXT 1656 3112 Left 2 !.param rise=1n
TEXT 1656 3144 Left 2 !.param reps=1
TEXT 1656 3288 Left 2 !;.step  temp -25 125 150
TEXT 1656 3328 Left 2 !.temp -25
TEXT 296 5384 Left 5 ;POR LOGIC
TEXT 1448 5400 Left 5 ;CLK GENERATOR

The netlist it stands for:
* clock_gen.asc
VCC VCC 0 {VCC}
Q11 CLK_8M N041 0 0 2N3904
D3 N041 CLK_8M BAT54
Q12 VCC _CLK_8M N038 0 2N3904
R9 VCC CLK_8M 100
R10 N038 N041 220
R11 N041 0 220
Q13 sys_clk5 N009 0 0 2N3904
D4 N009 sys_clk5 BAT54
Q14 VCC N001 N005 0 2N3904
R13 VCC sys_clk5 100
R14 N005 N009 220
R15 N009 0 220
Q15 VCC sys_clk1 N005 0 2N3904
Q16 0 sys_clk8 N001 0 2N3906
Q17 0 _CLK_8M N001 0 2N3906
R16 VCC N001 540
Q18 sys_clk1 N029 0 0 2N3904
D5 N029 sys_clk1 BAT54
Q19 VCC N018 N023 0 2N3904
R17 VCC sys_clk1 100
R18 N023 N029 220
R19 N029 0 220
Q20 VCC sys_clk5 N023 0 2N3904
Q21 0 sys_clk4 N018 0 2N3906
Q22 0 _CLK_8M N018 0 2N3906
R20 VCC N018 540
Q23 sys_clk6 N010 0 0 2N3904
D6 N010 sys_clk6 BAT54
Q24 VCC N002 N006 0 2N3904
R21 VCC sys_clk6 100
R22 N006 N010 220
R23 N010 0 220
Q25 VCC sys_clk2 N006 0 2N3904
Q26 0 sys_clk1 N002 0 2N3906
Q27 0 CLK_8M N002 0 2N3906
R24 VCC N002 540
Q28 sys_clk2 N030 0 0 2N3904
D7 N030 sys_clk2 BAT54
Q29 VCC N019 N024 0 2N3904
R25 VCC sys_clk2 100
R26 N024 N030 220
R27 N030 0 220
Q30 VCC sys_clk6 N024 0 2N3904
Q31 0 sys_clk5 N019 0 2N3906
Q32 0 CLK_8M N019 0 2N3906
R28 VCC N019 540
Q33 sys_clk7 N011 0 0 2N3904
D8 N011 sys_clk7 BAT54
Q34 VCC N003 N007 0 2N3904
R29 VCC sys_clk7 100
R30 N007 N011 220
R31 N011 0 220
Q35 VCC sys_clk3 N007 0 2N3904
Q36 0 sys_clk2 N003 0 2N3906
Q37 0 _CLK_8M N003 0 2N3906
R32 VCC N003 540
Q38 sys_clk3 N031 0 0 2N3904
D9 N031 sys_clk3 BAT54
Q39 VCC N020 N025 0 2N3904
R33 VCC sys_clk3 100
R34 N025 N031 220
R35 N031 0 220
Q40 VCC sys_clk7 N025 0 2N3904
Q41 0 sys_clk6 N020 0 2N3906
Q42 0 _CLK_8M N020 0 2N3906
R36 VCC N020 540
Q43 sys_clk8 N012 0 0 2N3904
D10 N012 sys_clk8 BAT54
Q44 VCC N004 N008 0 2N3904
R37 VCC sys_clk8 100
R38 N008 N012 220
R39 N012 0 220
Q45 VCC sys_clk4 N008 0 2N3904
Q46 0 sys_clk3 N004 0 2N3906
Q47 0 CLK_8M N004 0 2N3906
R40 VCC N004 540
Q48 sys_clk4 N032 0 0 2N3904
D11 N032 sys_clk4 BAT54
Q49 VCC N021 N026 0 2N3904
R41 VCC sys_clk4 100
R42 N026 N032 220
R43 N032 0 220
Q50 VCC sys_clk8 N026 0 2N3904
Q51 0 sys_clk7 N021 0 2N3906
Q52 0 CLK_8M N021 0 2N3906
R44 VCC N021 540
Q53 _CLK_8M N040 0 0 2N3904
D12 N040 _CLK_8M BAT54
Q54 VCC CLK_IN N036 0 2N3904
R45 VCC _CLK_8M 100
R46 N036 N040 220
R47 N040 0 220
Q1 VCC CLK_RST N036 0 2N3904
R1 VCC N035 100
C1 N035 0 10n
Q2 CLK_RST N039 0 0 2N3904
D1 N039 CLK_RST BAT54
Q3 VCC N035 N037 0 2N3904
R2 VCC CLK_RST 100
R3 N037 N039 220
R4 N039 0 220
Q4 VCC CLK_RST N005 0 2N3904
Q5 VCC CLK_RST N007 0 2N3904
Q6 CLK_IN N034 0 0 2N3904
D2 N034 CLK_IN BAT54
Q7 VCC N017 N028 0 2N3904
R5 VCC CLK_IN 100
R6 N028 N034 220
R7 N034 0 220
Q8 N016 N033 0 0 2N3904
D13 N033 N016 BAT54
Q9 VCC N022 N027 0 2N3904
R8 VCC N016 100
R12 N027 N033 220
R48 N033 0 220
R49 CLK_IN N017 1k
R50 N016 N013 1k
L1 CLK_IN N015 23.21588m
C2 N014 N015 17.05611f
C3 N013 CLK_IN 5.0117p
R51 N013 N014 14.59
R52 N017 N016 220
R53 N022 N013 220
C4 N013 0 22p
C5 CLK_IN 0 22p
.model D D
.lib standard.dio
.model NPN NPN
.model PNP PNP
.lib standard.bjt
.tran 5u uic
* .ac oct 100 1k 100mega
* .dc V_BIT0 0 {VCC} 0.01
.param VCC=3.3
.param freq=10Mega
.param rise=1n
.param reps=1
;.step  temp -25 125 150
.temp -25
* POR LOGIC
* CLK GENERATOR
.backanno
.end